# EasyEDA schematic AAA-SeSi+-SCH.json

## Sheets
1 Sheet_1: TITLE: Sheet_1; REV: 1.0; Date: 2025-12-20; Sheet: 1/1; Drawn By: pkibuku2; Company: Your Company
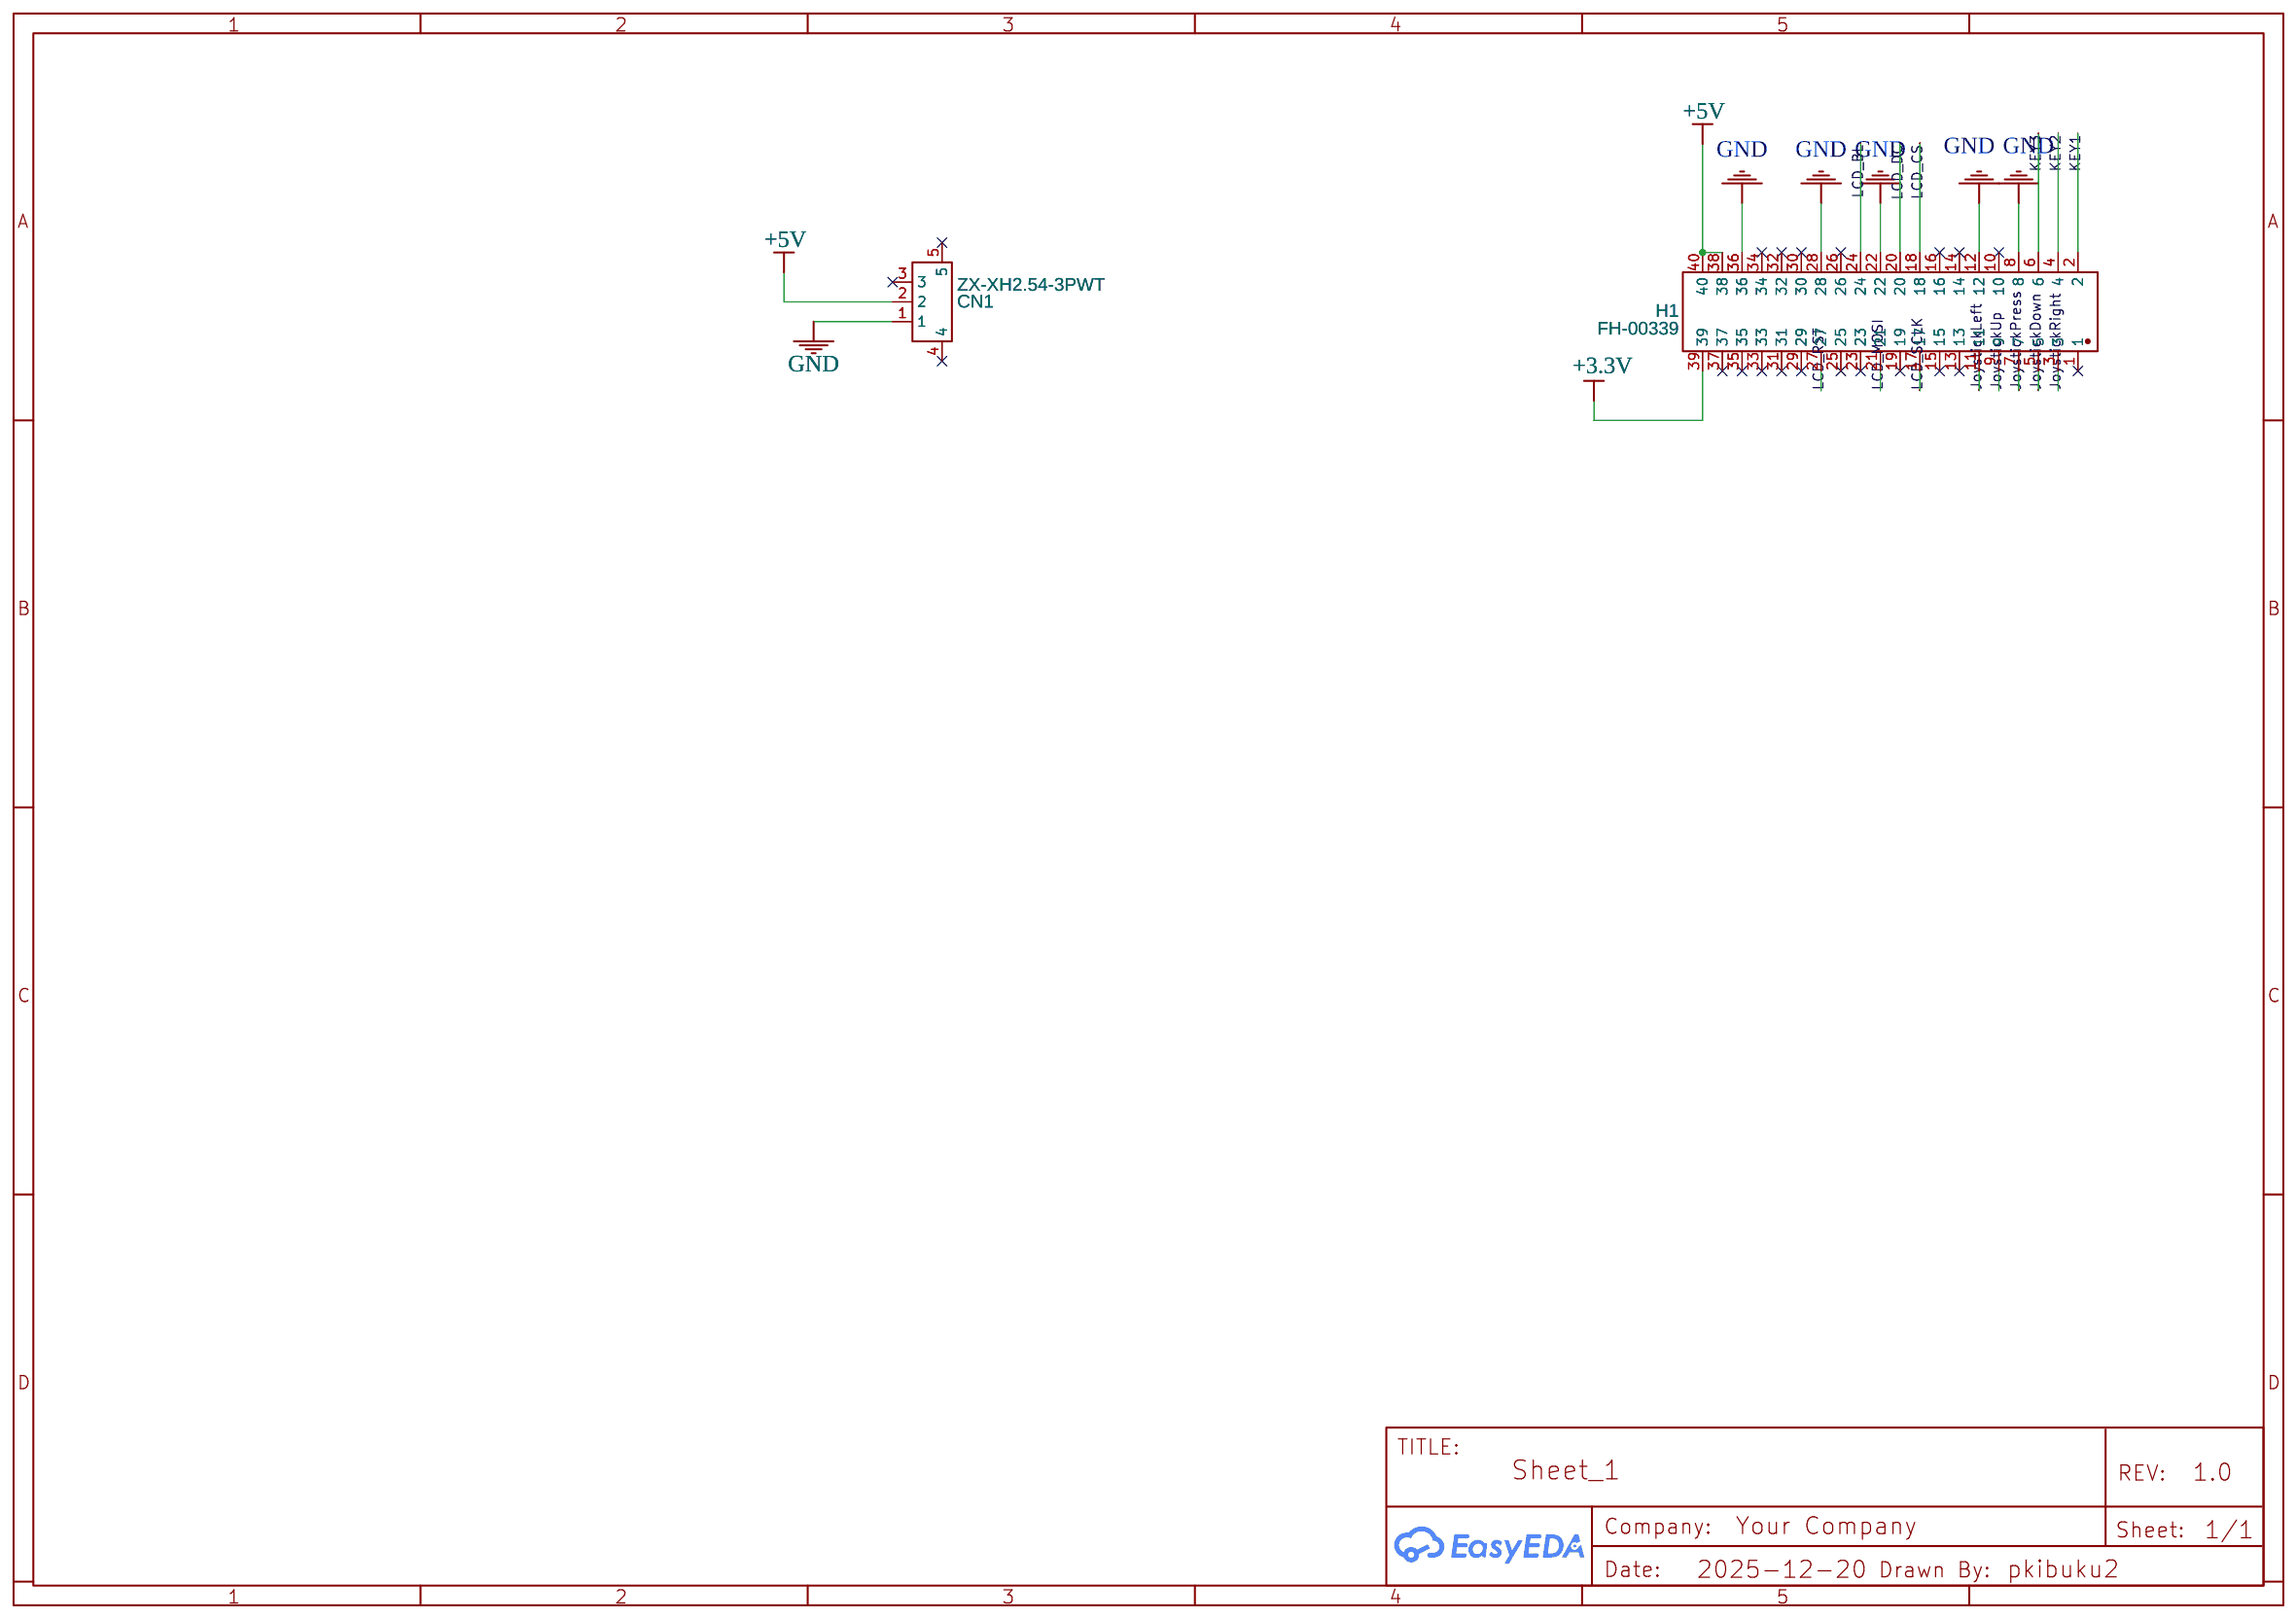
[diagram p0: Sheet_1]
2 Sheet_2: TITLE: Sheet_2; Date: 2025-12-21
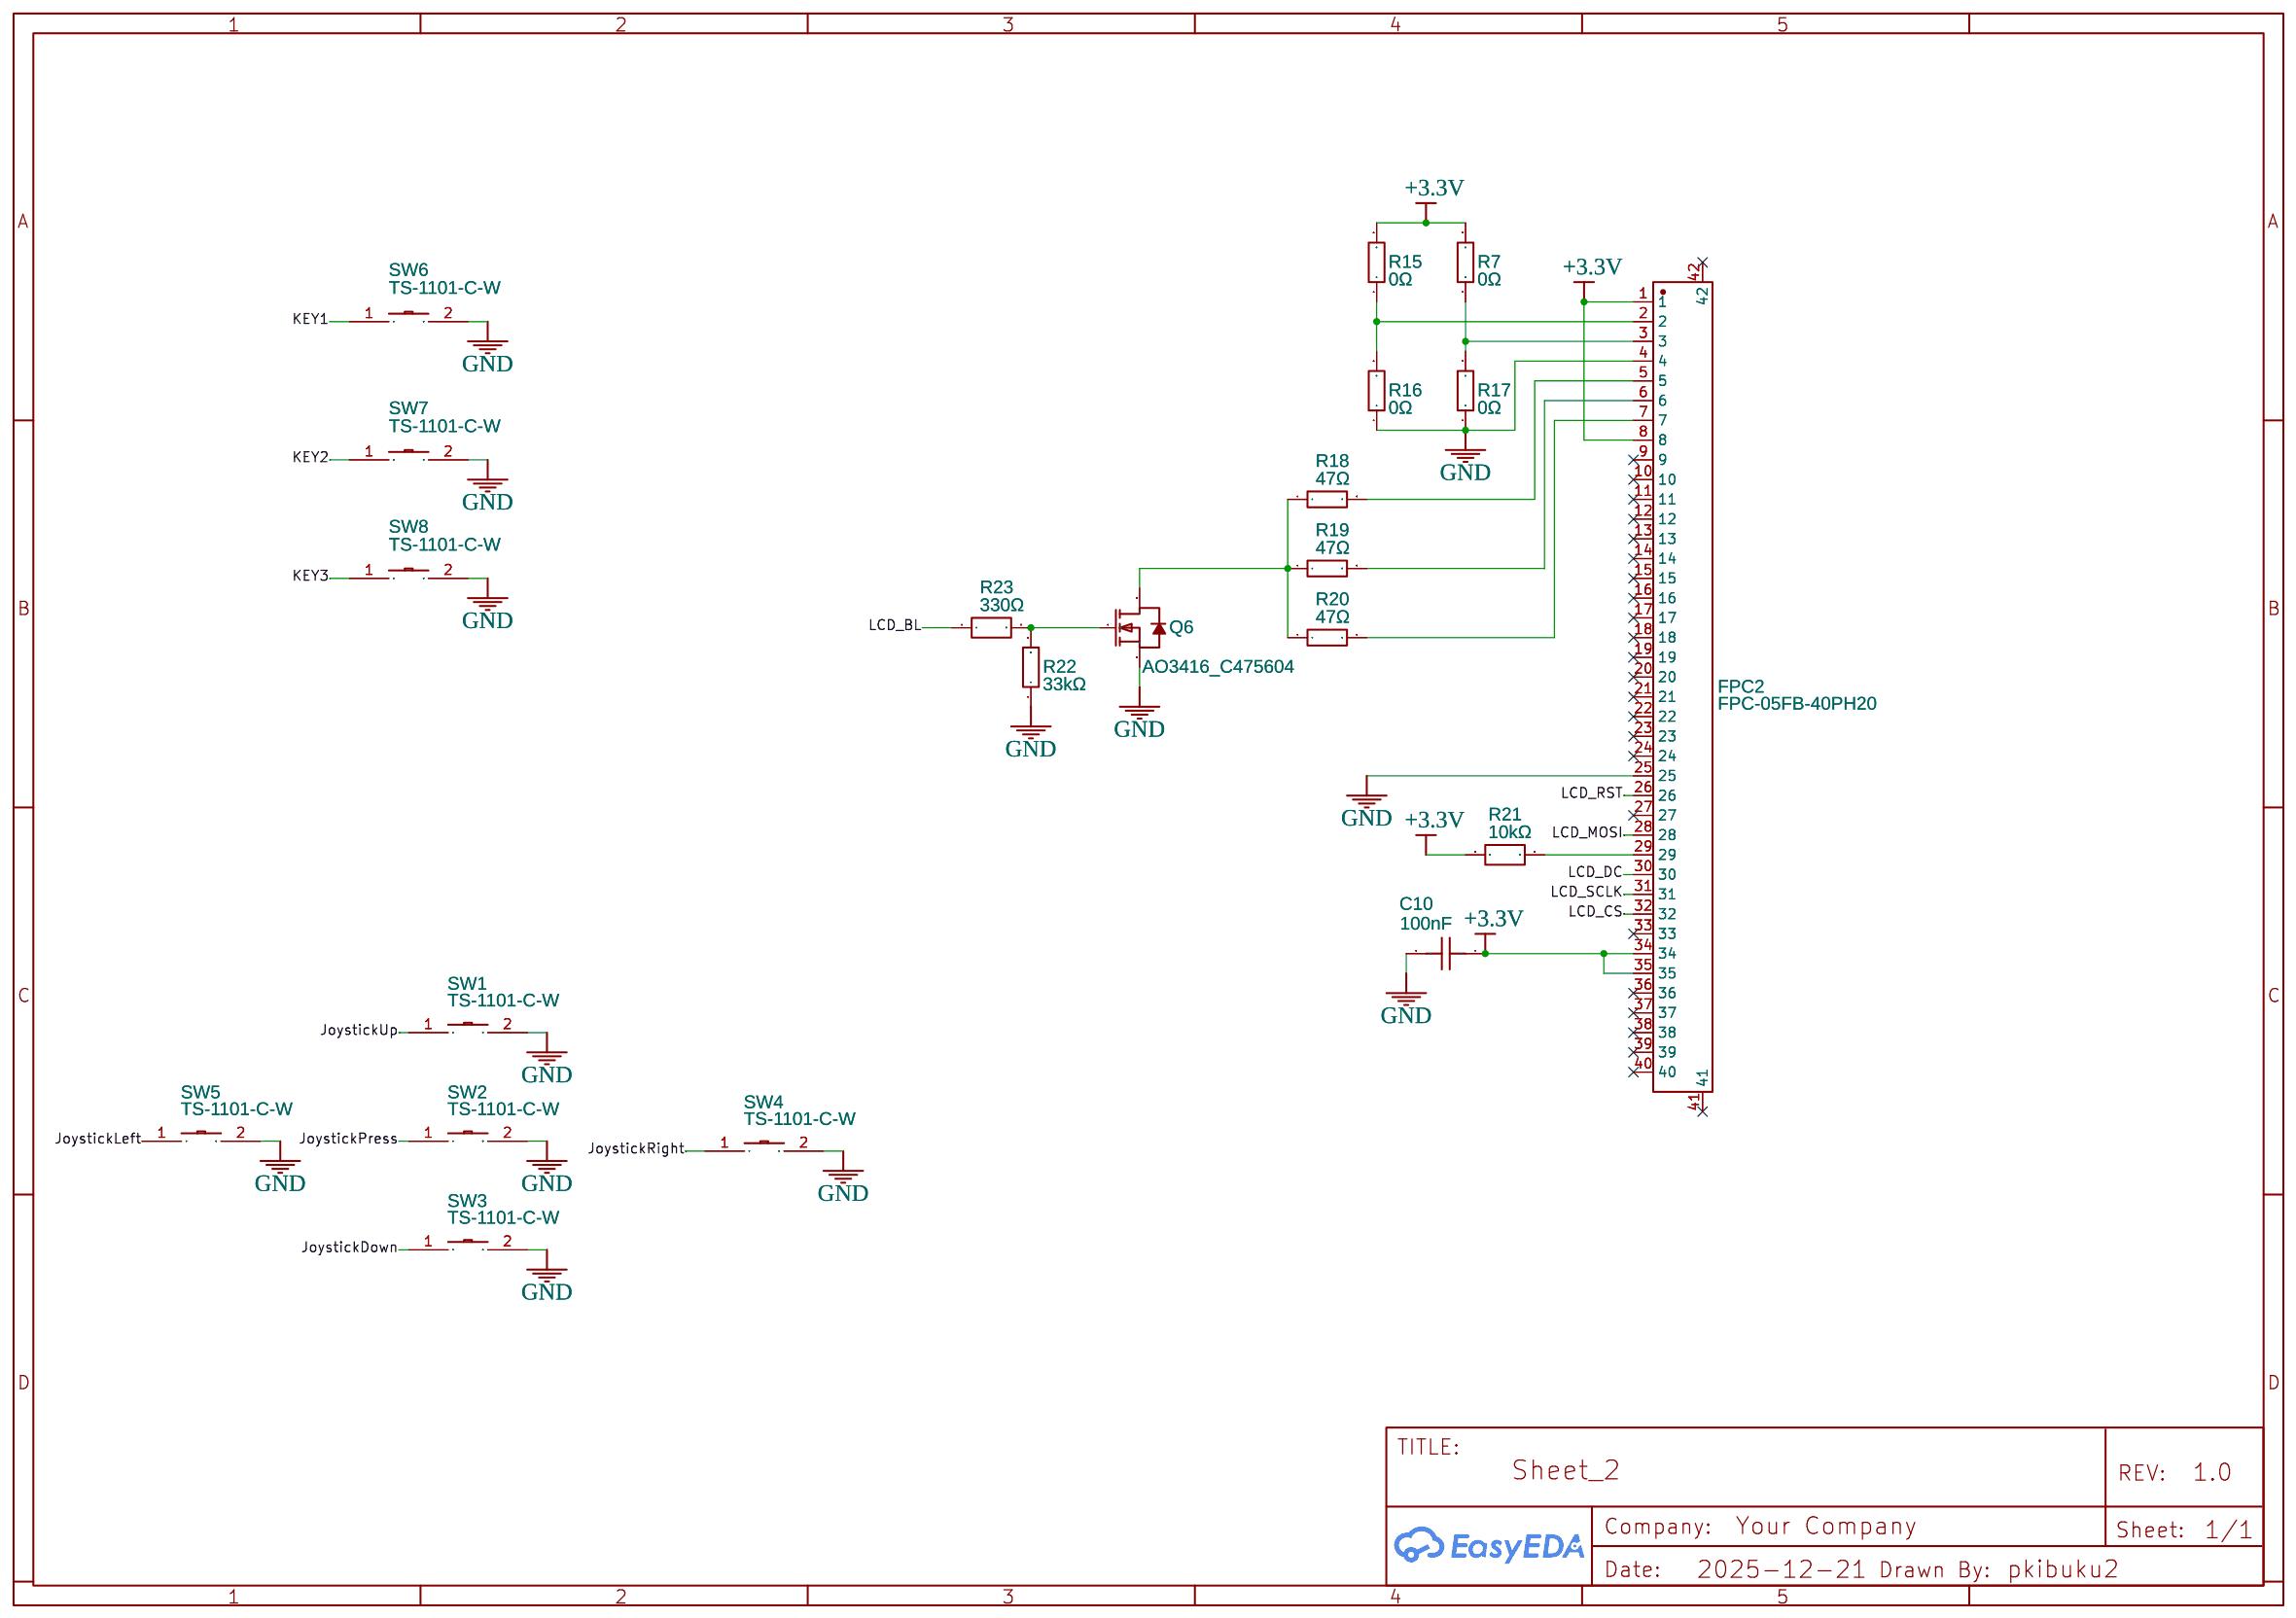
[diagram p1: Sheet_2]

## Parts
sheet Sheet_1
CN1  ZX-XH2.54-3PWT  [CONN-SMD_3P-P2.54-XH2.54-WT]
H1  FH-00339  [HDR-SMD_40P-P2.54-V-F-R2-C20-S6.6_FH-00339]
sheet Sheet_2
C10  100nF  [C0402]
FPC2  FPC-05FB-40PH20  [FPC-SMD_40P-P0.50_XUNPU_FPC-05FB-40PH20]
Q6  AO3416_C475604  [SC-59-3_L2.9-W1.6-P0.95-LS2.9-BR]
R7  0Ω  [R0402]
R15  0Ω  [R0402]
R16  0Ω  [R0402]
R17  0Ω  [R0402]
R18  47Ω  [R0402]
R19  47Ω  [R0402]
R20  47Ω  [R0402]
R21  10kΩ  [R0402]
R22  33kΩ  [R0402]
R23  330Ω  [R0402]
SW1  TS-1101-C-W  [SW-SMD_L6.0-W3.3-LS8.0]
SW2  TS-1101-C-W  [SW-SMD_L6.0-W3.3-LS8.0]
SW3  TS-1101-C-W  [SW-SMD_L6.0-W3.3-LS8.0]
SW4  TS-1101-C-W  [SW-SMD_L6.0-W3.3-LS8.0]
SW5  TS-1101-C-W  [SW-SMD_L6.0-W3.3-LS8.0]
SW6  TS-1101-C-W  [SW-SMD_L6.0-W3.3-LS8.0]
SW7  TS-1101-C-W  [SW-SMD_L6.0-W3.3-LS8.0]
SW8  TS-1101-C-W  [SW-SMD_L6.0-W3.3-LS8.0]

## Library data of the parts
CN1 = ZX-XH2.54-3PWT: Supplier: LCSC; Supplier Part: C7429672; Manufacturer: Megastar(兆星); JLCPCB Part Class: Extended Part; Contributor: lcsc
H1 = FH-00339: Contributor: LCSC; Supplier: LCSC; Supplier Part: C2685112; Manufacturer: Liansheng(连盛); JLCPCB Part Class: Extended Part
C10 = 04025C104KAT2A: Contributor: lcsc; Supplier: LCSC; Supplier Part: C2167244; Manufacturer: Kyocera AVX; JLCPCB Part Class: Extended Part
FPC2 = FPC-05FB-40PH20: Contributor: LCSC; Supplier: LCSC; Supplier Part: C2856837; Manufacturer: XUNPU(讯普); JLCPCB Part Class: Extended Part
Q6 = AO3416_C475604: Contributor: LCSC; Supplier: LCSC; Supplier Part: C475604; Manufacturer: SHIKUES(时科); Manufacturer Part: SK3416; JLCPCB Part Class: Extended Part; link: https://lcsc.com/eda_search?q=C475604&%26type=1&ref=editor
R7 R15-R17 = 0402WGF0000TCE: Supplier: LCSC; Manufacturer: UNI-ROYAL(厚声); Supplier Part: C17168; JLCPCB Part Class: Basic Part
R18-R20 = 0402WGJ0470TCE: Supplier: LCSC; Manufacturer: UNI-ROYAL(厚声); Supplier Part: C25168; JLCPCB Part Class: Extended Part
R21 = 0402WGD1002TCE: Contributor: LCSC; Supplier: LCSC; Supplier Part: C407753; Manufacturer: UNI-ROYAL(厚声); JLCPCB Part Class: Extended Part
R22 = 0402WGF3302TCE: Supplier: LCSC; Manufacturer: UNI-ROYAL(厚声); Supplier Part: C25779; JLCPCB Part Class: Basic Part
R23 = 0402WGD3300TCE: Contributor: LCSC; Supplier: LCSC; Supplier Part: C423288; Manufacturer: UNI-ROYAL(厚声); JLCPCB Part Class: Extended Part
SW1-SW8 = TS-1101-C-W: Contributor: LCSC; Supplier: LCSC; Supplier Part: C318938; Manufacturer: XKB Connectivity(中国星坤); JLCPCB Part Class: Extended Part

## Nets
+3.3V: C10.1 FPC2.1 FPC2.8 FPC2.34 FPC2.35 H1.39 R7.2 R15.2 R21.2
+5V: CN1.2 H1.38 H1.40
GND: C10.2 CN1.1 FPC2.4 FPC2.25 H1.8 H1.12 H1.22 H1.28 H1.36 Q6.2(S) R16.1 R17.1 R22.1 SW1.2 SW2.2 SW3.2 SW4.2 SW5.2 SW6.2 SW7.2 SW8.2
JoystickDown: H1.5 SW3.1
JoystickLeft: H1.11 SW5.1
JoystickPress: H1.7 SW2.1
JoystickRight: H1.3 SW4.1
JoystickUp: H1.9 SW1.1
KEY1: H1.2 SW6.1
KEY2: H1.4 SW7.1
KEY3: H1.6 SW8.1
LCD_BL: H1.24 R23.1
LCD_CS: FPC2.32 H1.18
LCD_DC: FPC2.30 H1.20
LCD_MOSI: FPC2.28 H1.21
LCD_RST: FPC2.26 H1.27
LCD_SCLK: FPC2.31 H1.17
Net-(FPC2-2): FPC2.2 R15.1 R16.2
Net-(FPC2-3): FPC2.3 R7.1 R17.2
Net-(FPC2-5): FPC2.5 R18.2
Net-(FPC2-6): FPC2.6 R19.2
Net-(FPC2-7): FPC2.7 R20.2
Net-(FPC2-29): FPC2.29 R21.1
Net-(Q6-1): Q6.1(G) R22.2 R23.2
Net-(Q6-3): Q6.3(D) R18.1 R19.1 R20.1

Not connected (* = marked no-connect by the designer): CN1 3* 4* 5*; FPC2 9* 10* 11* 12* 13* 14* 15* 16* 17* 18* 19* 20* 21* 22* 23* 24* 27* 33* 36* 37* 38* 39* 40* 41* 42*; H1 1* 10* 13* 14* 15* 16* 19* 23* 25* 26* 29* 30* 31* 32* 33* 34* 35* 37*
